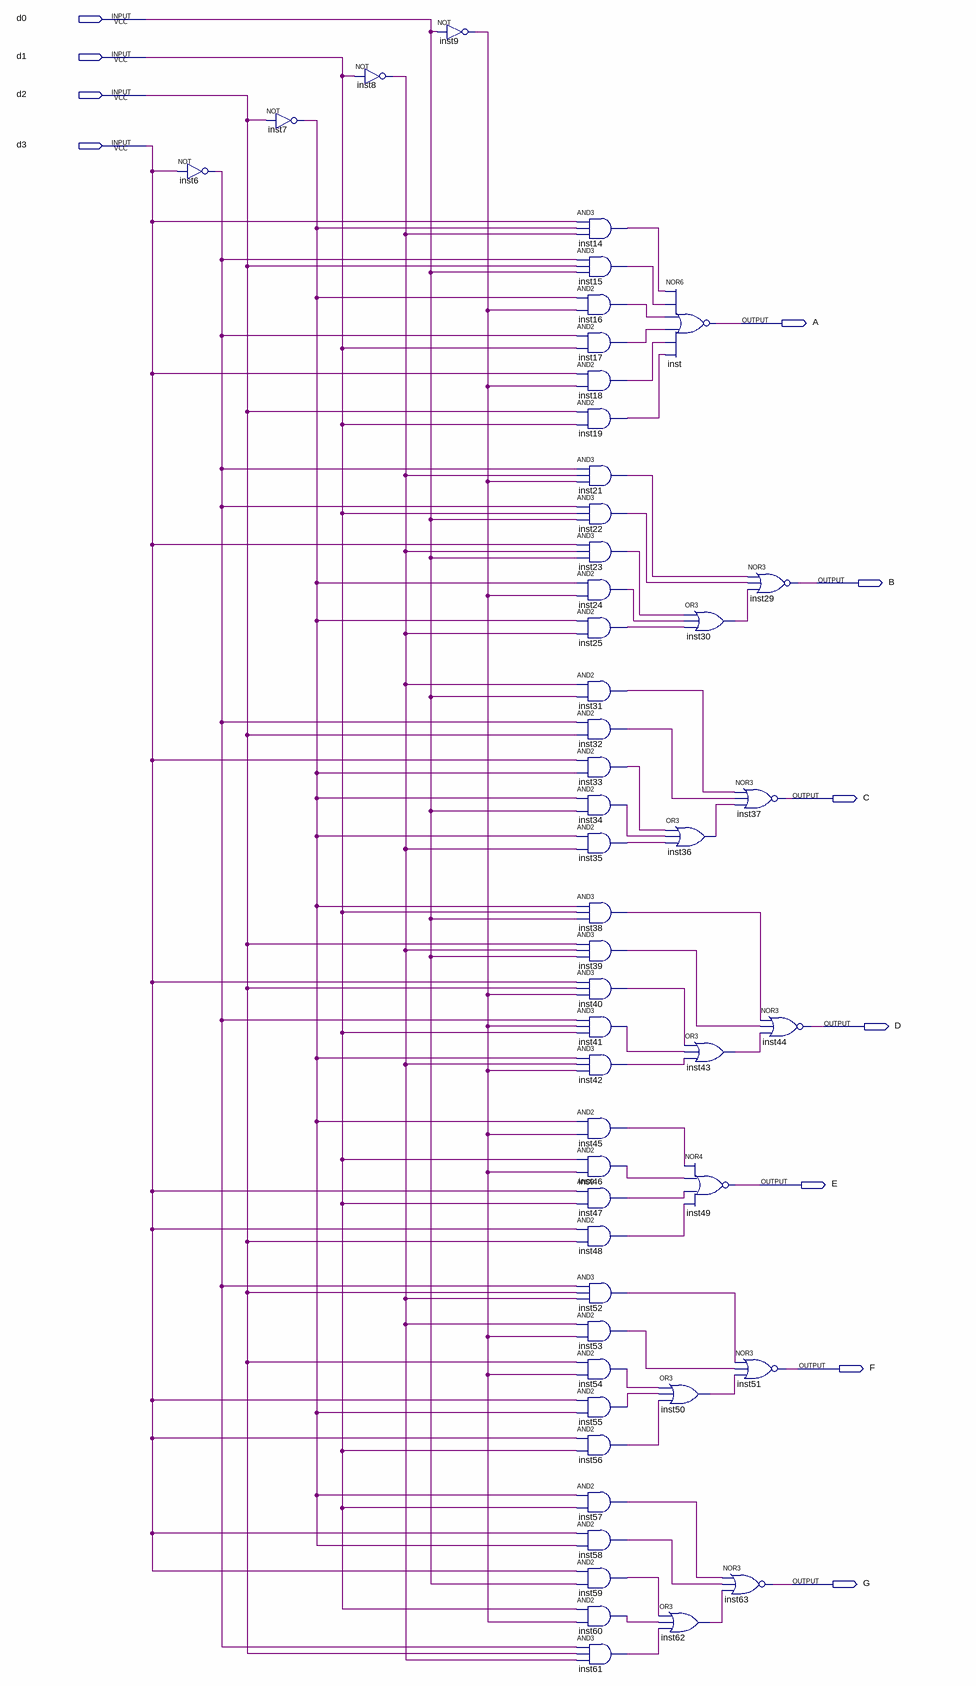
[diagram p0: schematic sheet]
// Quartus schematic sevensegmentdisplay.bdf as structural Verilog: 51 symbols, 11 pins
module sevensegmentdisplay (
  input  d0,
  input  d1,
  input  d2,
  input  d3,
  output A,
  output B,
  output C,
  output D,
  output E,
  output F,
  output G
);

  wire inst6_out, inst7_out, inst8_out, inst9_out, inst14_out, inst15_out, inst16_out, inst17_out,
       inst18_out, inst19_out, inst21_out, inst22_out, inst23_out, inst24_out, inst25_out, inst30_out,
       inst31_out, inst32_out, inst33_out, inst34_out, inst35_out, inst36_out, inst38_out, inst39_out,
       inst40_out, inst41_out, inst42_out, inst43_out, inst45_out, inst46_out, inst47_out, inst48_out,
       inst50_out, inst52_out, inst53_out, inst54_out, inst55_out, inst56_out, inst57_out, inst58_out,
       inst59_out, inst60_out, inst61_out, inst62_out;

  not inst6 (inst6_out, d3);
  not inst7 (inst7_out, d2);
  not inst8 (inst8_out, d1);
  not inst9 (inst9_out, d0);
  and inst14 (inst14_out, d3, inst7_out, inst8_out);
  and inst15 (inst15_out, inst6_out, d2, d0);
  and inst16 (inst16_out, inst7_out, inst9_out);
  and inst17 (inst17_out, inst6_out, d1);
  and inst18 (inst18_out, d3, inst9_out);
  and inst19 (inst19_out, d2, d1);
  and inst21 (inst21_out, inst6_out, inst8_out, inst9_out);
  and inst22 (inst22_out, inst6_out, d1, d0);
  and inst23 (inst23_out, d3, inst8_out, d0);
  and inst24 (inst24_out, inst7_out, inst9_out);
  and inst25 (inst25_out, inst7_out, inst8_out);
  and inst31 (inst31_out, inst8_out, d0);
  and inst32 (inst32_out, inst6_out, d2);
  and inst33 (inst33_out, d3, inst7_out);
  and inst34 (inst34_out, inst7_out, d0);
  and inst35 (inst35_out, inst7_out, inst8_out);
  and inst38 (inst38_out, inst7_out, d1, d0);
  and inst39 (inst39_out, d2, inst8_out, d0);
  and inst40 (inst40_out, d3, d2, inst9_out);
  and inst41 (inst41_out, inst6_out, inst9_out, d1);
  and inst42 (inst42_out, inst7_out, inst8_out, inst9_out);
  and inst45 (inst45_out, inst7_out, inst9_out);
  and inst46 (inst46_out, d1, inst9_out);
  and inst47 (inst47_out, d3, d1);
  and inst48 (inst48_out, d3, d2);
  and inst52 (inst52_out, inst6_out, d2, inst8_out);
  and inst53 (inst53_out, inst8_out, inst9_out);
  and inst54 (inst54_out, d2, inst9_out);
  and inst55 (inst55_out, d3, inst7_out);
  and inst56 (inst56_out, d3, d1);
  and inst57 (inst57_out, inst7_out, d1);
  and inst58 (inst58_out, d3, inst7_out);
  and inst59 (inst59_out, d3, d0);
  and inst60 (inst60_out, d1, inst9_out);
  and inst61 (inst61_out, inst6_out, d2, inst8_out);
  nor inst (A, inst14_out, inst15_out, inst16_out, inst17_out, inst18_out, inst19_out);
  or inst36 (inst36_out, inst33_out, inst34_out, inst35_out);
  or inst50 (inst50_out, inst54_out, inst55_out, inst56_out);
  or inst62 (inst62_out, inst59_out, inst60_out, inst61_out);
  or inst30 (inst30_out, inst23_out, inst24_out, inst25_out);
  or inst43 (inst43_out, inst40_out, inst41_out, inst42_out);
  nor inst49 (E, inst45_out, inst46_out, inst47_out, inst48_out);
  nor inst29 (B, inst21_out, inst22_out, inst30_out);
  nor inst37 (C, inst31_out, inst32_out, inst36_out);
  nor inst44 (D, inst38_out, inst39_out, inst43_out);
  nor inst51 (F, inst52_out, inst53_out, inst50_out);
  nor inst63 (G, inst57_out, inst58_out, inst62_out);
endmodule
